# EAGLE design HVRescue_Shield_r212 (EAGLE 6.1)
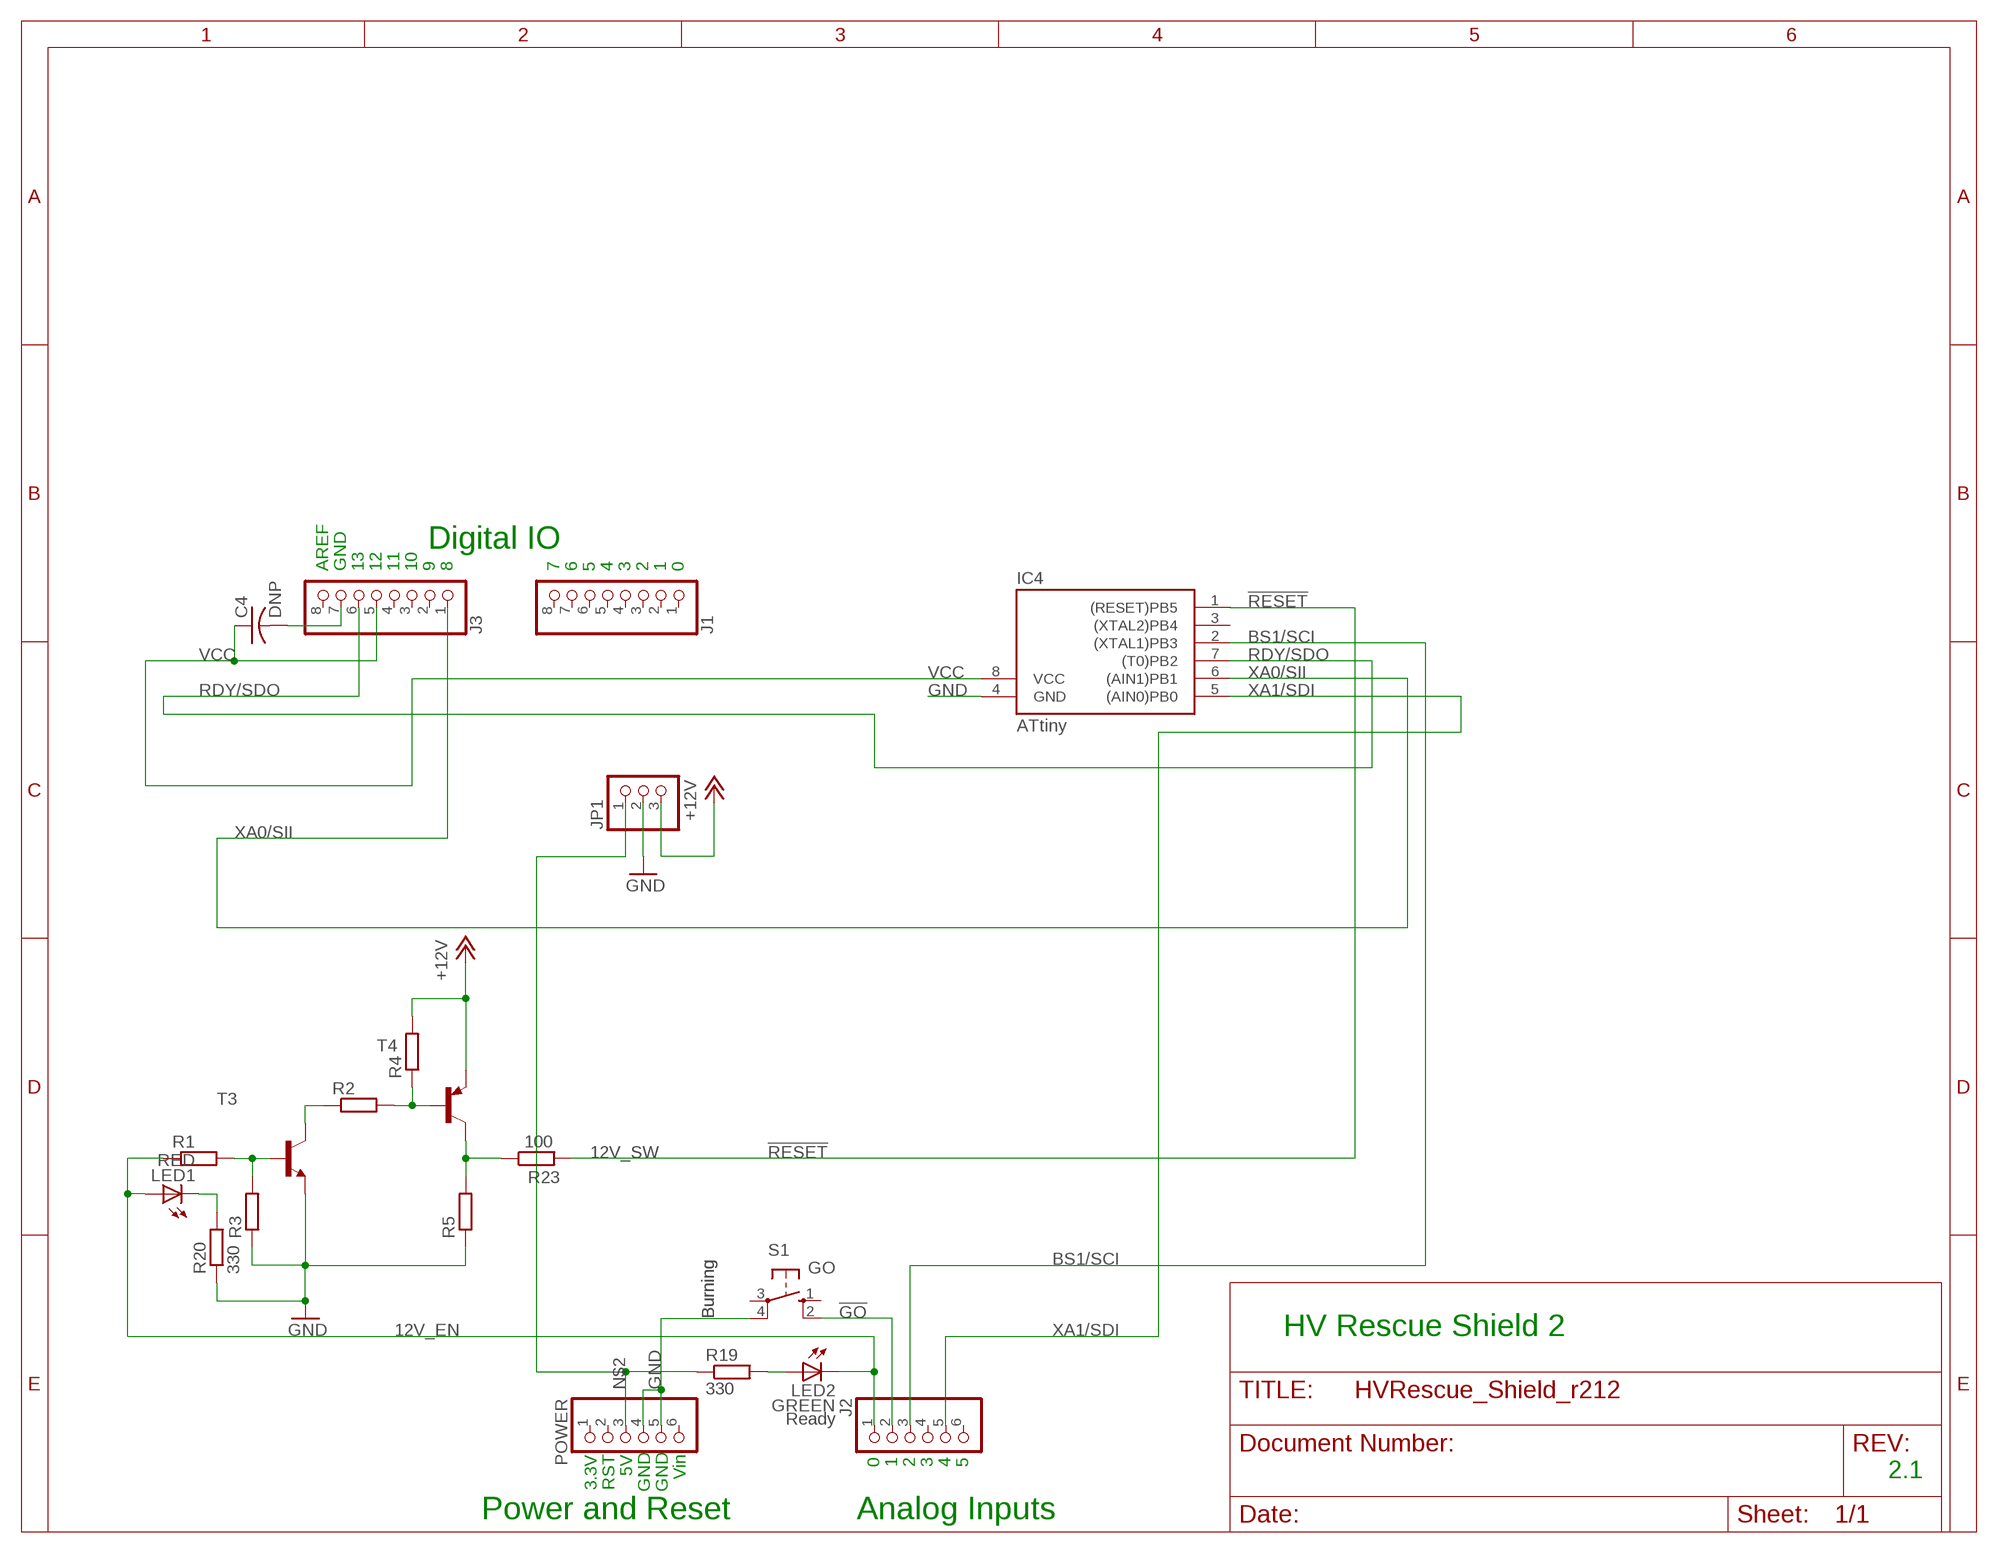
[diagram p0: schematic, sheet 1]

## Parts
C4  DNP  C-US025-025X050  [C025-025X050]
IC4  ATtiny  TINY10P  [DIL08]
J1  PINHD-1X8  [1X08]
J2  PINHD-1X6  [1X06]
J3  PINHD-1X8  [1X08]
JP1  PINHD-1X3  [1X03]
LED1  RED  LED3MM  [LED3MM]
LED2  GREEN  LED3MM  [LED3MM]
POWER  PINHD-1X6  [1X06]
R1  R-EU_0207/7  [0207/7]
R2  R-EU_0207/7  [0207/7]
R3  R-EU_0207/7  [0207/7]
R4  R-EU_0207/7  [0207/7]
R5  R-EU_0207/7  [0207/7]
R19  330  R-EU_0207/7  [0207/7]
R20  330  R-EU_0207/7  [0207/7]
R23  100  R-EU_0207/7  [0207/7]
S1  GO  10-XX  [B3F-10XX]
T3  -NPN-TO92-ECB  [TO92-ECB]
T4  -PNP-TO92-CEB  [TO92-CEB]

## Nets
12V_EN: J2.1 LED1.A LED2.K(C) R1.1
12V_SW: R5.2 R23.1 T4.C
!GO: J2.2 S1.2(S1)
!RESET: IC4.1((RESET)PB5) R23.2
+12V: JP1.3 R4.2 T4.E
BS1/SCI: IC4.2((XTAL1)PB3) J2.3
GND: IC4.4(GND) JP1.2 POWER.4 POWER.5 R3.1 R5.1 R20.1 S1.4(P1) T3.E
N$1: LED1.K(C) R20.2
N$2: JP1.1 POWER.3 R19.1
N$3: R1.2 R3.2 T3.B
N$4: R2.1 T3.C
N$5: R2.2 R4.1 T4.B
N$7: LED2.A R19.2
N$21: C4.2 J3.7
RDY/SDO: IC4.7((T0)PB2) J3.6
VCC: C4.1 IC4.8(VCC) J3.5
XA0/SII: IC4.6((AIN1)PB1) J3.1
XA1/SDI: IC4.5((AIN0)PB0) J2.5
Unconnected: IC4.3((XTAL2)PB4) J1.1 J1.2 J1.3 J1.4 J1.5 J1.6 J1.7 J1.8 J2.4 J2.6 J3.2 J3.3 J3.4 J3.8 POWER.1 POWER.2 POWER.6 S1.1(S) S1.3(P)

## Notes on the sheet
- Digital IO
- AREF | GND | 13 | 12 | 11 | 10 | 9 | 8 | 7 | 6 | 5 | 4 | 3 | 2 | 1 | 0
- Burning | Burning
- HV Rescue Shield 2
- Ready
- 0 | 1 | 2 | 3 | 4 | 5
- 5V | Vin | 2.1
- 3.3V | RST | GND | GND
- Power and Reset | Analog Inputs

## Library data of the parts
C4 = rcl:C-US: CAPACITOR, American symbol
IC4 = avr-6:TINY10: MICROCONTROLLER 1 Kbytes ROM
J1 J3 = mightyohm:PINHD-1X8: PIN HEADER
J2 POWER = mightyohm:PINHD-1X6: PIN HEADER
JP1 = pinhead:PINHD-1X3: PIN HEADER
LED1 LED2 = mightyohm:LED: MightyOhm Engineering Light Emitting Diodes (LEDs)
R1-R5 R19 R20 R23 = rcl:R-EU_: RESISTOR, European symbol
S1 = switch-omron:10-XX: OMRON SWITCH; MPN: B3F-1000; OC_FARNELL: 176432; OC_NEWARK: 36M3542
T3 = transistor:*-NPN-: NPN Transistror BF959 corrected 2008.03.06
T4 = transistor:*-PNP-: PNP Transistror

## Net classes
0 default: width 0.305 mm, drill 0.508 mm, clearance 0.203 mm
1 power: width 0.61 mm, drill 0.508 mm, clearance 0.152 mm
2 gnd: width 0.305 mm, drill 0.508 mm, clearance 0.152 mm
3 usbvcc: width 0.508 mm, drill 0.508 mm, clearance 0.152 mm
4 aref: width 0.406 mm

## Board
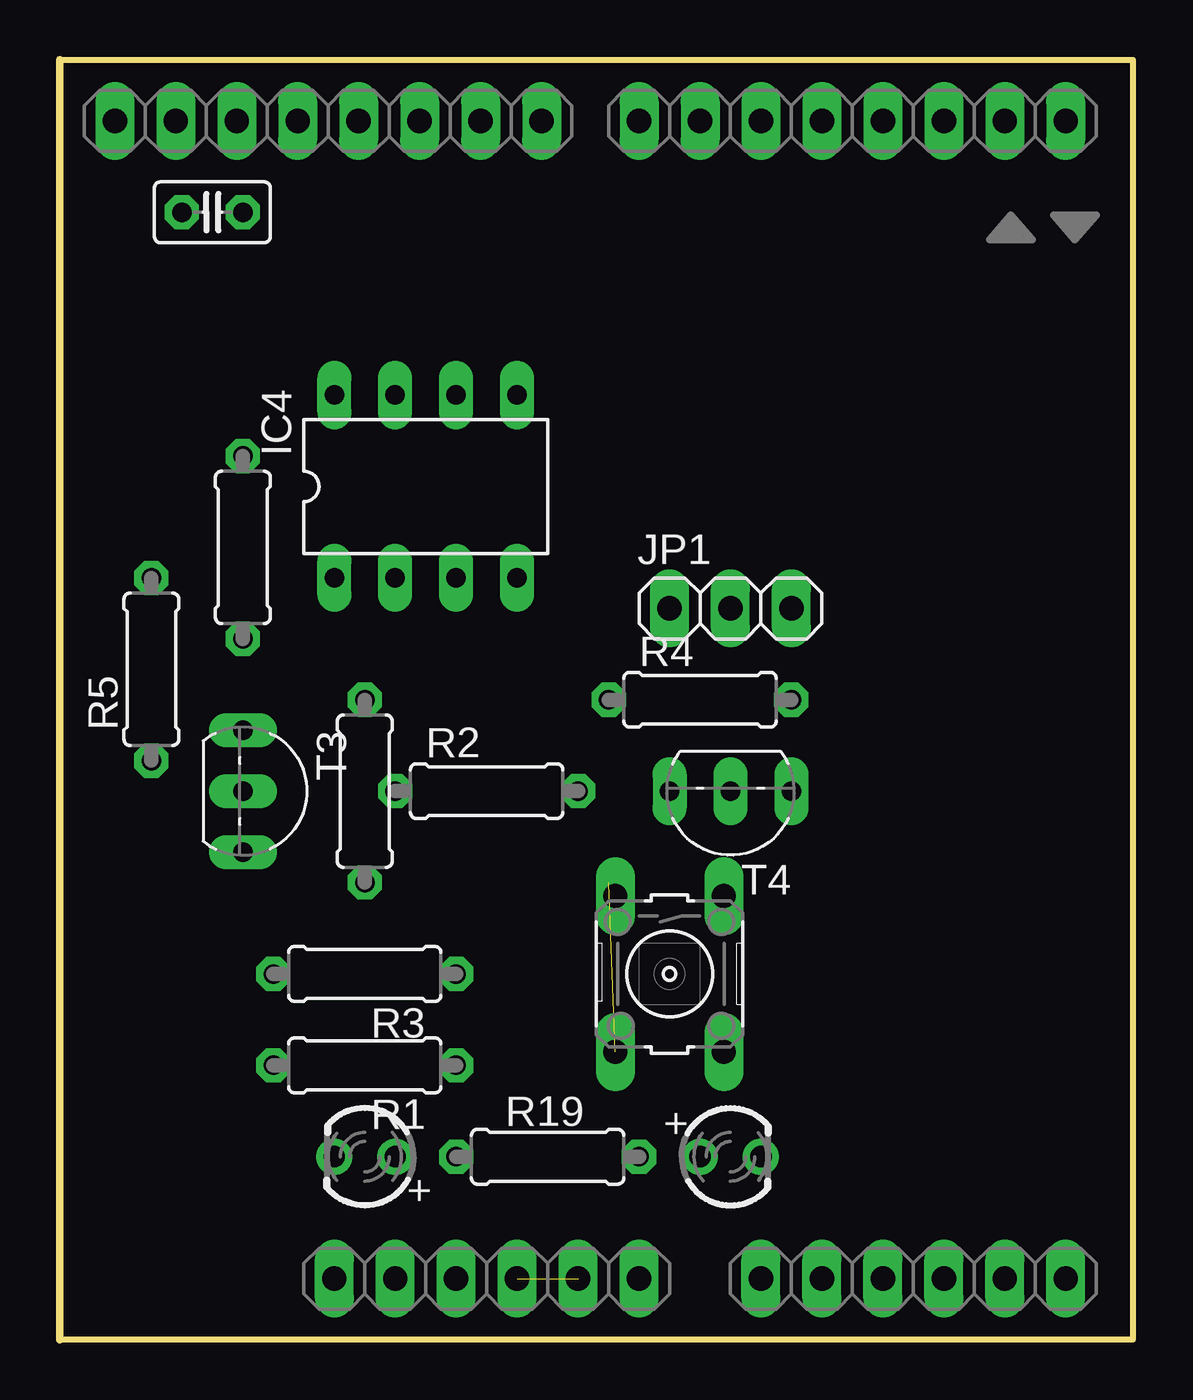
[diagram p1: board, top side]
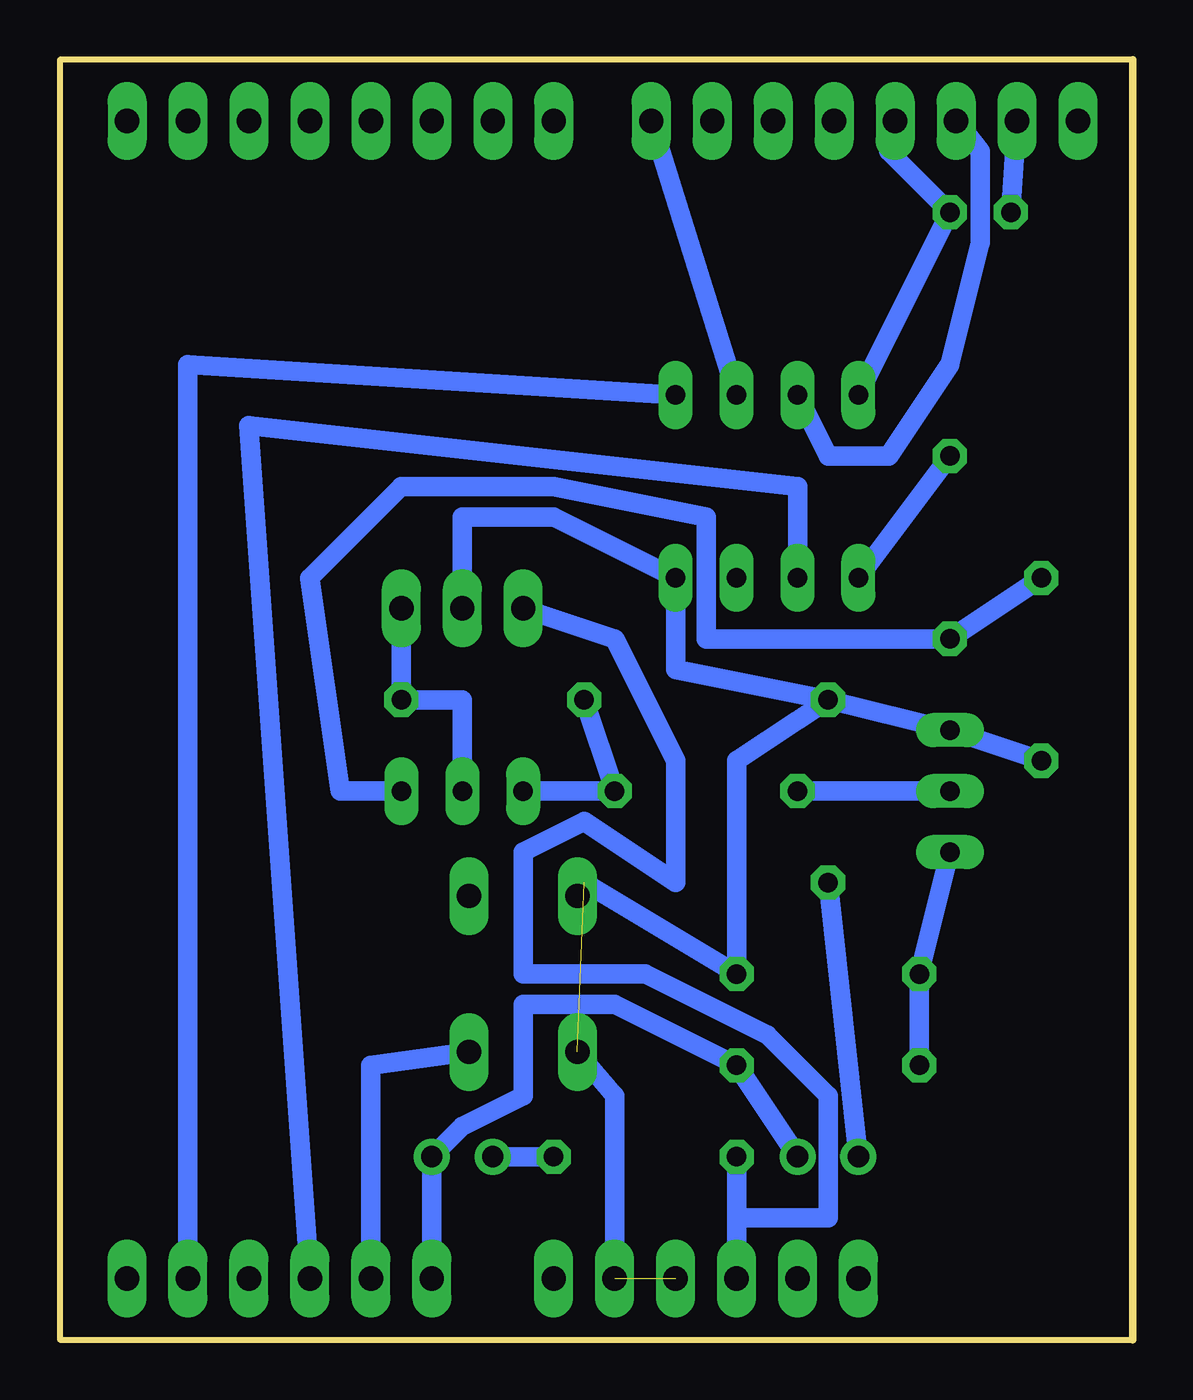
[diagram p2: board, bottom side, seen from below]

Size 44.7 x 53.34 mm. Coordinates in mm from the lower left corner, seen from the top.
Outline: 0,53.34 44.7,53.34 44.7,0 0,0 0,53.34
Copper layers (1*16): Top 0.035mm / dielectric 1.5mm / Bottom 0.0356mm
Design rules: minimum track width 8mil, minimum drill 20mil, track to track 8mil, track to pad 8mil, pad to pad 8mil, via to via 8mil, smd to smd 0mil, copper to edge 15mil, drill to drill 10mil, minimum pad ring 12mil, minimum via ring 8mil, stop-mask expansion 4mil, vias tented up to drill 25mil, thermal gap 12mil
tRestrict: area -18.5,3.6 to -3.3,17
bRestrict: area -18.5,3.6 to -3.3,17

### Footprints (pad centres in the part's own frame; a part is rotated, then mirrored left to right if it is on the bottom)
C025-025X050 = drill 0.813 octagon: 1 -1.27,0; 2 1.27,0
DIL08 = drill 0.813 long: 1 -3.81,-3.81; 2 -1.27,-3.81; 3 1.27,-3.81; 4 3.81,-3.81; 5 3.81,3.81; 6 1.27,3.81; 7 -1.27,3.81; 8 -3.81,3.81
1X08 = drill 1.016 long: 1 -8.89,0; 2 -6.35,0; 3 -3.81,0; 4 -1.27,0; 5 1.27,0; 6 3.81,0; 7 6.35,0; 8 8.89,0
1X06 = drill 1.016 long: 1 -6.35,0; 2 -3.81,0; 3 -1.27,0; 4 1.27,0; 5 3.81,0; 6 6.35,0
1X03 = drill 1.016 long: 1 -2.54,0; 2 0,0; 3 2.54,0
LED3MM = drill 0.889: A -1.27,0; K 1.27,0
0207/7 = drill 0.813 octagon: 1 -3.81,0; 2 3.81,0
B3F-10XX = drill 1.016 long: 1 -3.251,2.261; 2 3.251,2.261; 3 -3.251,-2.261; 4 3.251,-2.261
TO92-ECB = drill 0.813 long: B 2.54,0; C 0,0; E -2.54,0
TO92-CEB = drill 0.813 long: B 2.54,0; C -2.54,0; E 0,0

### Placement (x,y rotation side)
C4  6.35,46.99 180 top
IC4  15.24,35.56 0 top
J1  33.02,50.8 180 top
J2  35.56,2.54 0 top
J3  11.18,50.8 180 top
JP1  27.94,30.48 0 top
LED1  12.7,7.62 180 top
LED2  27.94,7.62 0 top
POWER  17.78,2.54 0 top
R1  12.7,11.43 180 top
R2  17.78,22.86 0 top
R3  12.7,15.24 180 top
R4  26.67,26.67 0 top
R5  3.81,27.94 90 top
R19  20.32,7.62 0 top
R20  12.7,22.86 270 top
R23  7.62,33.02 90 top
S1  25.4,15.24 270 top
T3  7.62,22.86 270 top
T4  27.94,22.86 180 top

### Tracks (layer width: path | path; a pad name or v marks a point on that pad's centre or on a via)
12V_EN
  Bottom 0.813: LED1.A R1.1 21.59,13.97 25.4,13.97 25.4,10.16 27.94,8.89 LED2.K J2.1
12V_SW
  Bottom 0.813: R5.2 R23.1 17.78,29.21 17.78,34.29 24.13,35.56 30.48,35.56 34.29,31.75 33.02,22.86 T4.C
!GO
  Bottom 0.813: J2.2 31.75,11.43 S1.2
!RESET
  Bottom 0.813: R23.2 IC4.1
+12V
  Bottom 0.813: JP1.3 R4.2 27.94,26.67 T4.E
BS1/SCI
  Bottom 0.813: J2.3 36.83,38.1 13.97,35.56 IC4.2
GND  (2 unrouted)
  Bottom 0.813: POWER.5 21.59,10.16 S1.4 | 22.86,19.05 R3.1 16.51,24.13 R20.1 | R5.1 T3.E R20.1 | JP1.2 27.94,34.29 24.13,34.29 IC4.4 19.05,27.94 R20.1
N$1
  Bottom 0.813: LED1.K R20.2
N$2
  Bottom 0.813: R19.1 16.51,5.08 | 16.51,5.08 POWER.3 | JP1.1 21.59,29.21 19.05,24.13 19.05,19.05 22.86,21.59 25.4,20.32 25.4,15.24 20.32,15.24 15.24,12.7 12.7,10.16 12.7,5.08 16.51,5.08
N$3
  Bottom 0.813: R1.2 R3.2 T3.B
N$4
  Bottom 0.813: T3.C R2.1
N$5
  Bottom 0.813: R4.1 R2.2 T4.B
N$7
  Bottom 0.813: R19.2 LED2.A
N$21
  Bottom 0.813: J3.7 C4.2
RDY/SDO
  Bottom 0.813: IC4.7 12.7,36.83 10.16,36.83 7.62,40.64 6.35,45.72 6.35,49.53 J3.6
VCC
  Bottom 0.813: J3.5 10.16,49.53 C4.1 IC4.8
XA0/SII
  Bottom 0.813: J3.1 IC4.6
XA1/SDI
  Bottom 0.813: J2.5 39.37,40.64 IC4.5

### Text on the board
tDocu: 3 2 1 0 9 8 | 7 6 5 4 3 2 1 0 | GND | 1 1 1 1 | DIGITAL | AREF | TX | RX | PWM | PWM | PWM | PWM | PWM | PWM | ANALOG IN | RESET | 3V3 | 5V Gnd Vin | 0 1 2 3 4 5